# Altium schematic sheet Laser_driver.SchDoc: Title
size 420 x 297 mm; Author: G.Kasprowicz; CompanyName: WUT ISE; DrawnBy: G.Kasprowicz; Organization: WUT ISE; Address1: PW ISE; Address2: Nowowiejska 15/19 00-665 Warsaw; Address3: gkasprow@gmail.com; Revision: 1.0; SheetNumber: -; SheetTotal: -; ModifiedBy: -; CheckedDate: -; Title2: Title2; DivGrp: WUT ISE; Designer: G.Kasprowicz; SPICEModelCacheRYPVXPCY: <root> / <DocumentId>RYPVXPCY</DocumentId> / </root>; ModifiedDate: -; ProjectName: Sensor Box
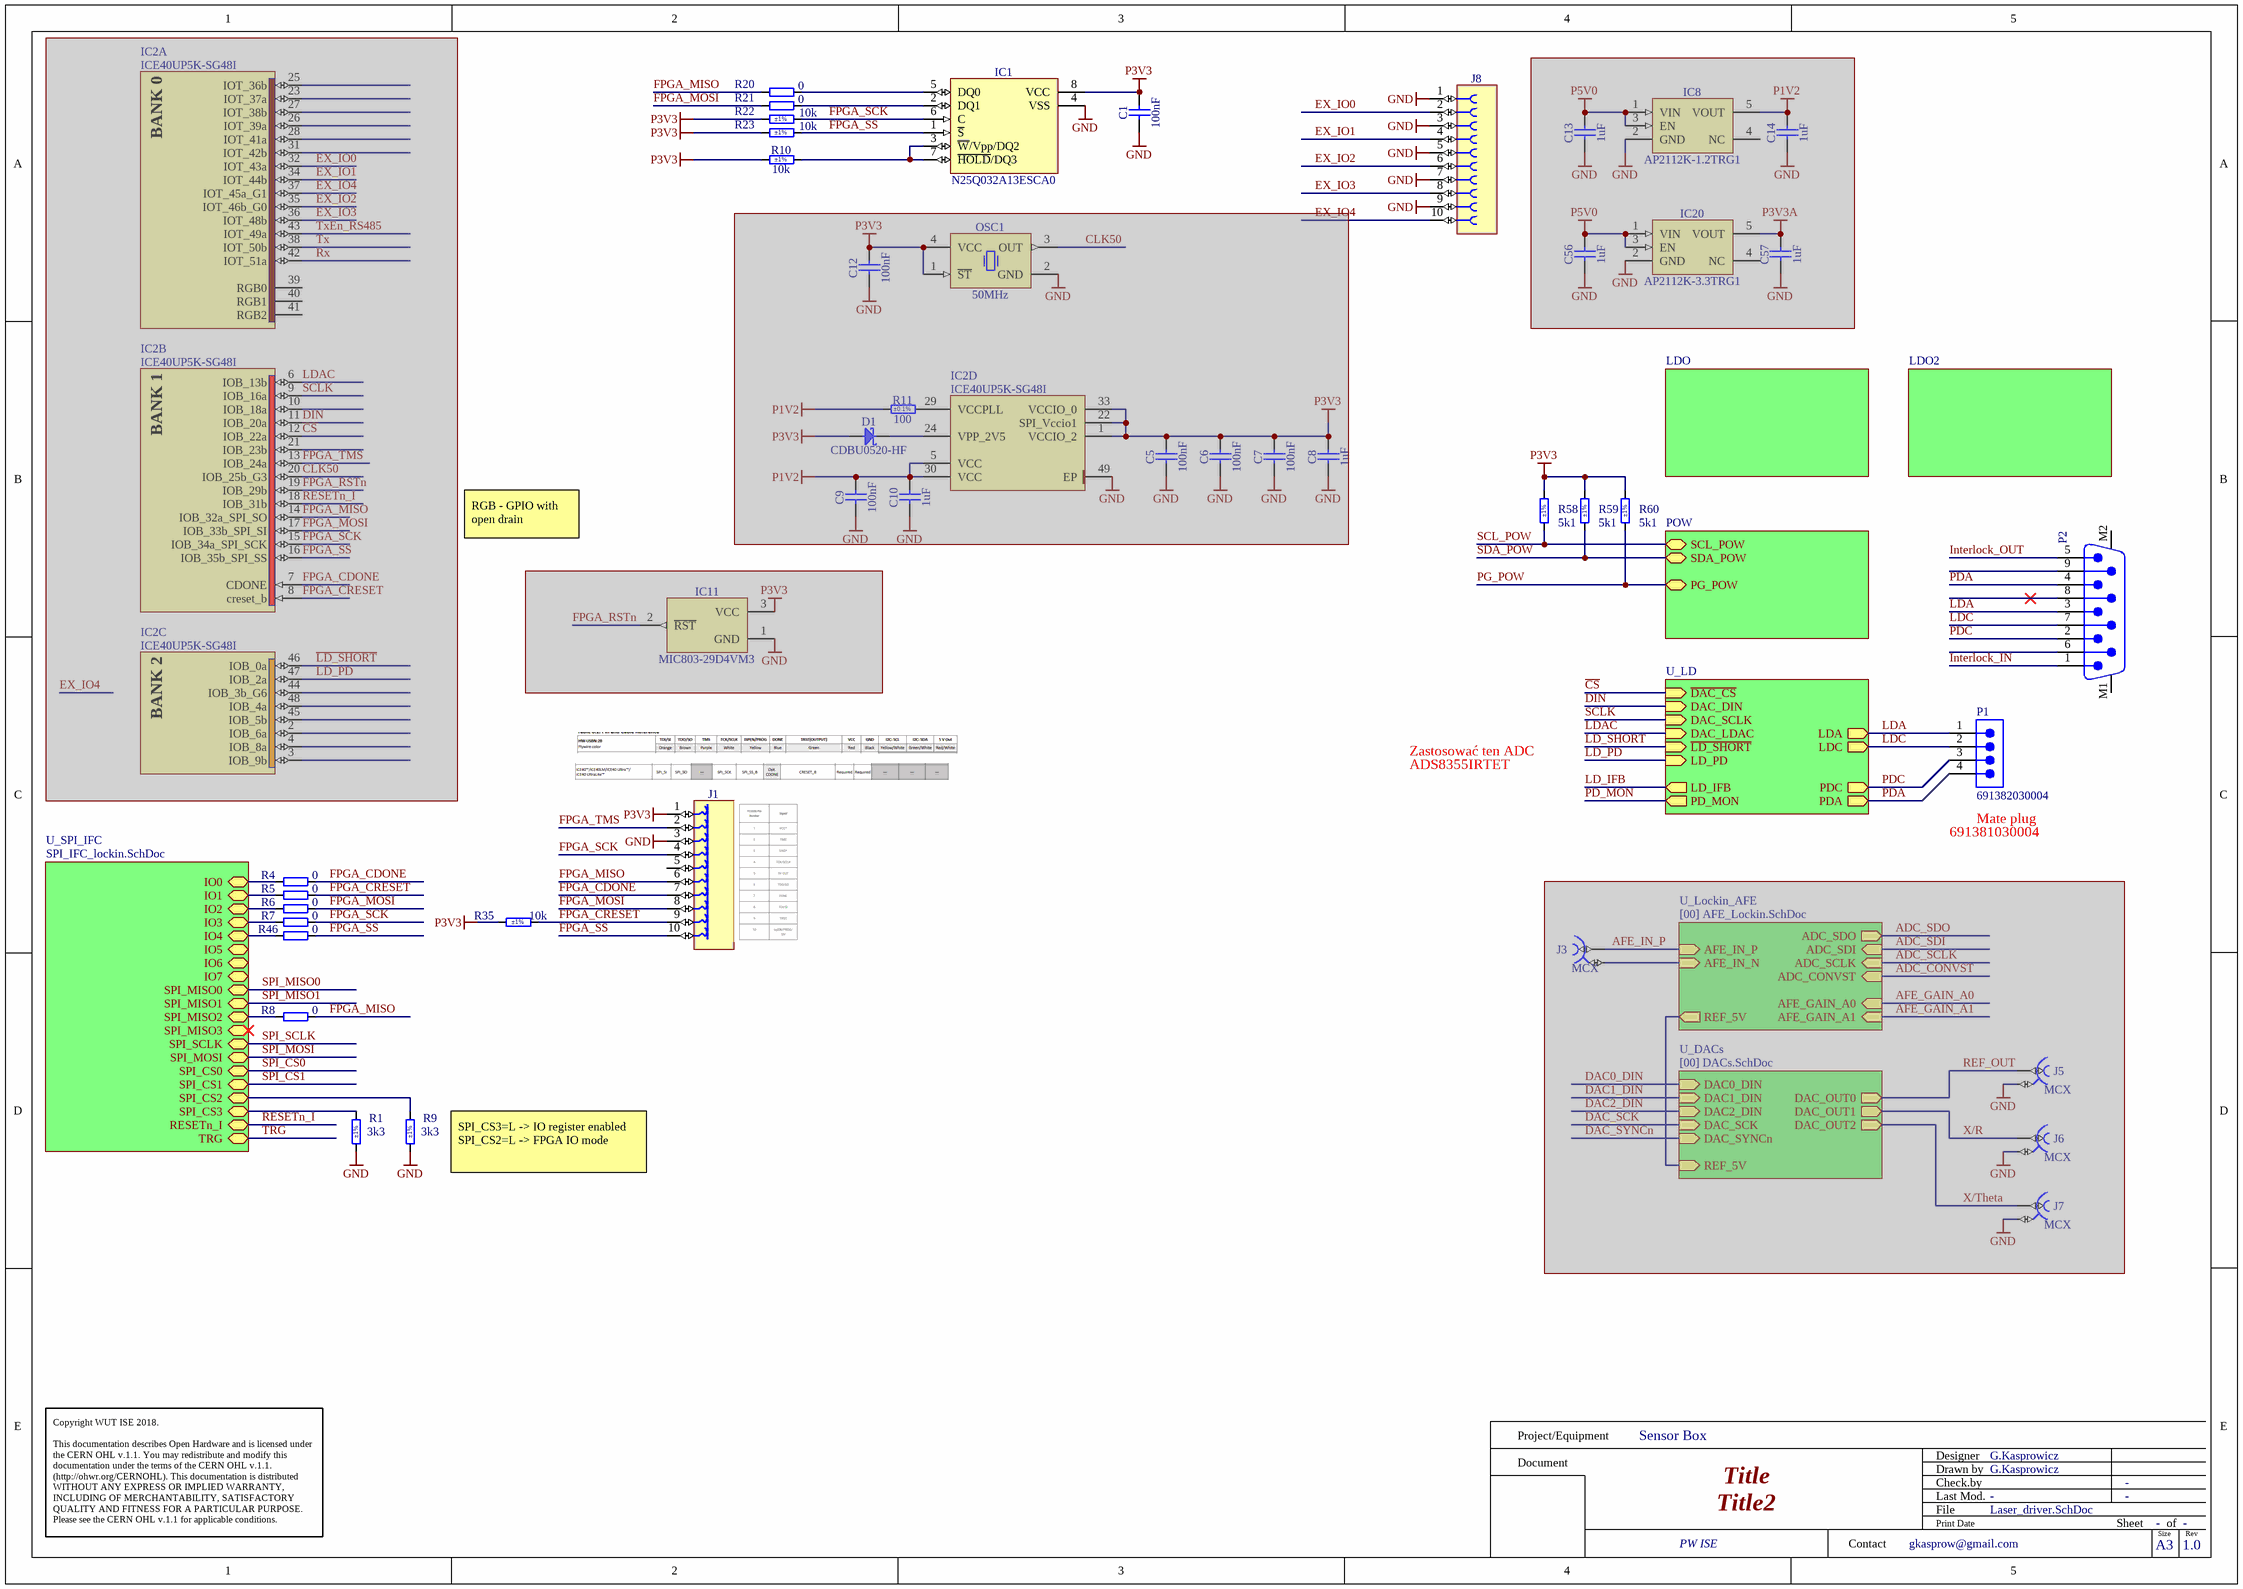
[diagram p0: Laser_driver.SchDoc]

## Parts
C1  100nF  [CAPC1005X55N]
C5  100nF  [CAPC1005X55N]  (masked out: inside a compile mask, not in the netlist)
C6  100nF  [CAPC1005X55N]  (masked out: inside a compile mask, not in the netlist)
C7  100nF  [CAPC1005X55N]  (masked out: inside a compile mask, not in the netlist)
C8  1uF  [CAPC1005X55N]  (masked out: inside a compile mask, not in the netlist)
C9  100nF  [CAPC1005X55N]  (masked out: inside a compile mask, not in the netlist)
C10  1uF  [CAPC1005X55N]  (masked out: inside a compile mask, not in the netlist)
C12  100nF  [CAPC1005X55N]  (masked out: inside a compile mask, not in the netlist)
C13  1uF  [CAPC1005X55N]  (masked out: inside a compile mask, not in the netlist)
C14  1uF  [CAPC1005X55N]  (masked out: inside a compile mask, not in the netlist)
C56  1uF  [CAPC1005X55N]  (masked out: inside a compile mask, not in the netlist)
C57  1uF  [CAPC1005X55N]  (masked out: inside a compile mask, not in the netlist)
D1  CDBU0520-HF  [SOD-523F]  (masked out: inside a compile mask, not in the netlist)
IC1  N25Q032A13ESCA0  [SOIC127P600X175-8N]
IC2  ICE40UP5K-SG48I  [QFN50P700X700X100-49N-S550]  (parts A,B,C,D of 4)  (masked out: inside a compile mask, not in the netlist)
IC8  AP2112K-1.2TRG1  [SOT95P285X140-5N]  (masked out: inside a compile mask, not in the netlist)
IC11  MIC803-29D4VM3  [SOT95P237X112-3N]  (masked out: inside a compile mask, not in the netlist)
IC20  AP2112K-3.3TRG1  [SOT95P285X140-5N]  (masked out: inside a compile mask, not in the netlist)
J1  TC2050-IDC  [TC2050-IDC]  (value not drawn)
J3  MCX  [AMPHENOL_919-109J-51PX]  (masked out: inside a compile mask, not in the netlist)
J5  MCX  [AMPHENOL_919-109J-51PX]  (masked out: inside a compile mask, not in the netlist)
J6  MCX  [AMPHENOL_919-109J-51PX]  (masked out: inside a compile mask, not in the netlist)
J7  MCX  [AMPHENOL_919-109J-51PX]  (masked out: inside a compile mask, not in the netlist)
J8  FFC/FPC  [MOLEX_52745-1097]  (value not drawn)
OSC1  50MHz  [OSC_EPSON_SG-310]  (masked out: inside a compile mask, not in the netlist)
P1  691382030004  [691382030004]
P2  61800929221  [61800929221]  (value not drawn)
R1  3k3  Tolerance: ±1%  [RESC1005X40N]
R4  0  [RESC1005X40N]
R5  0  [RESC1005X40N]
R6  0  [RESC1005X40N]
R7  0  [RESC1005X40N]
R8  0  [RESC1005X40N]
R9  3k3  Tolerance: ±1%  [RESC1005X40N]
R10  10k  Tolerance: ±1%  [RESC1005X40N]
R11  100  Tolerance: ±0.1%  [RESC1005X35N]  (masked out: inside a compile mask, not in the netlist)
R20  0  [RESC1005X40N]
R21  0  [RESC1005X40N]
R22  10k  Tolerance: ±1%  [RESC1005X40N]
R23  10k  Tolerance: ±1%  [RESC1005X40N]
R35  10k  Tolerance: ±1%  [RESC1005X40N]
R46  0  [RESC1005X40N]
R58  5k1  Tolerance: ±1%  [RESC1005X40N]
R59  5k1  Tolerance: ±1%  [RESC1005X40N]
R60  5k1  Tolerance: ±1%  [RESC1005X40N]

## Sub-sheets
LDO = LDO_LD.SchDoc: no entries
LDO2 = OPAmp Supply.SchDoc: no entries
POW = [05] POW_LD.SchDoc: SDA_POW (bidir), SCL_POW (bidir), PG_POW (bidir)
U_DACs = [00] DACs.SchDoc (masked out): DAC0_DIN (in), DAC_SCK (in), DAC_SYNCn (in), DAC1_DIN (in), DAC2_DIN (in), REF_5V (in), DAC_OUT0 (out), DAC_OUT1 (out), DAC_OUT2 (out)
U_LD = LD.SchDoc: LDA (out), LDC (out), PDC (out), PDA (out), ~{LD_SHORT} (in), LD_PD (in), PD_MON (out), ~{DAC_CS} (in), DAC_DIN (in), DAC_SCLK (in), DAC_LDAC (in), LD_IFB (out)
U_Lockin_AFE = [00] AFE_Lockin.SchDoc (masked out): ADC_SDI (in), ADC_SCLK (in), ADC_SDO (out), ADC_CONVST (in), AFE_GAIN_A0 (in), AFE_GAIN_A1 (in), AFE_IN_N (in), AFE_IN_P (in), REF_5V (out)
U_SPI_IFC = SPI_IFC_lockin.SchDoc: IO0 (bidir), IO1 (bidir), IO2 (bidir), IO3 (bidir), IO4 (bidir), IO5 (bidir), IO6 (bidir), IO7 (bidir), SPI_MISO0 (bidir), SPI_MISO1 (bidir), SPI_MISO2 (bidir), SPI_MISO3 (bidir), SPI_SCLK (bidir), SPI_MOSI (bidir), SPI_CS0 (bidir), SPI_CS1 (bidir), SPI_CS2 (bidir), SPI_CS3 (bidir), RESETn_I (bidir), TRG (bidir)

## Nets
GND: C1.1 IC1.4(VSS) J1.3 J8.1 J8.3 J8.5 J8.7 J8.9 R1.2 R9.2
P3V3: C1.2 IC1.8(VCC) J1.1 R10.1 R22.1 R23.1 R35.1 R58.1 R59.1 R60.1
~{CS}: sheet U_LD/~{DAC_CS}
DIN: sheet U_LD/DAC_DIN
EX_IO0: J8.2
EX_IO1: J8.4
EX_IO2: J8.6
EX_IO3: J8.8
FPGA_CDONE: J1.7 R4.2
FPGA_CRESET: J1.9 R5.2 R35.2
FPGA_MISO: J1.6 R8.2 R20.1
FPGA_MOSI: J1.8 R6.2 R21.1
FPGA_SCK: IC1.6(C) J1.4 R7.2 R22.2
FPGA_SS: IC1.1(~{S}) J1.10 R23.2 R46.2
FPGA_TMS: J1.2
Interlock_IN: P2.1
Interlock_OUT: P2.5
~{LD_SHORT}: sheet U_LD/~{LD_SHORT}
LD_IFB: sheet U_LD/LD_IFB
LD_PD: sheet U_LD/LD_PD
LDA: P1.1 P2.3 ; sheet U_LD/LDA
LDAC: sheet U_LD/DAC_LDAC
LDC: P1.2 P2.7 ; sheet U_LD/LDC
PD_MON: sheet U_LD/PD_MON
PDA: P1.4 P2.4 ; sheet U_LD/PDA
PDC: P1.3 P2.2 ; sheet U_LD/PDC
PG_POW: R60.2 ; sheet POW/PG_POW
RESETn_I: sheet U_SPI_IFC/RESETn_I
SCL_POW: R58.2 ; sheet POW/SCL_POW
SCLK: sheet U_LD/DAC_SCLK
SDA_POW: R59.2 ; sheet POW/SDA_POW
SPI_CS0: sheet U_SPI_IFC/SPI_CS0
SPI_CS1: sheet U_SPI_IFC/SPI_CS1
SPI_MISO0: sheet U_SPI_IFC/SPI_MISO0
SPI_MISO1: sheet U_SPI_IFC/SPI_MISO1
SPI_MOSI: sheet U_SPI_IFC/SPI_MOSI
SPI_SCLK: sheet U_SPI_IFC/SPI_SCLK
TRG: sheet U_SPI_IFC/TRG
NetIC1_2: IC1.2(DQ1) R21.2
NetIC1_3: IC1.3(~{W}/Vpp/DQ2) IC1.7(~{HOLD}/DQ3) R10.2
NetIC1_5: IC1.5(DQ0) R20.2
NetR1_1: R1.1 ; sheet U_SPI_IFC/SPI_CS3
NetR4_1: R4.1 ; sheet U_SPI_IFC/IO0
NetR5_1: R5.1 ; sheet U_SPI_IFC/IO1
NetR6_1: R6.1 ; sheet U_SPI_IFC/IO2
NetR7_1: R7.1 ; sheet U_SPI_IFC/IO3
NetR8_1: R8.1 ; sheet U_SPI_IFC/SPI_MISO2
NetR9_1: R9.1 ; sheet U_SPI_IFC/SPI_CS2
NetR46_1: R46.1 ; sheet U_SPI_IFC/IO4

Not connected (* = marked no-connect by the designer): J1 5; J8 10; P2 6 8* 9 M1 M2

## Notes on the sheet
- RGB - GPIO with open drain
- ADS8355IRTET
- Zastosować ten ADC
- (near P1) 691381030004
- (near P1) Mate plug
- (near R9) SPI_CS3=L -> IO register enabled
  SPI_CS2=L -> FPGA IO mode
- Project/Equipment
- Document
- Designer
- Drawn by
- Check.by
- Copyright WUT ISE 2018.
  This documentation describes Open Hardware and is licensed under the CERN OHL v.1.1. You may redistribute and modify this documentation under the terms of the CERN OHL v.1.1. (http://ohwr.org/CERNOHL). This documentation is distributed WITHOUT ANY EXPRESS OR IMPLIED WARRANTY, INCLUDING OF MERCHANTABILITY, SATISFACTORY QUALITY AND FITNESS FOR A PARTICULAR PURPOSE. Please see the CERN OHL v.1.1 for applicable conditions.
- Contact
- File
- Last Mod.
- Print Date
- Sheet
- Size
- A3
- of
- Rev
- (in symbol ICE40UP5K-SG48I, part A) BANK 0
- (in symbol ICE40UP5K-SG48I, part B) BANK 1
- (in symbol ICE40UP5K-SG48I, part C) BANK 2

## Library data of the parts
C1 C5-C7 C9 C12 = CC0402_100NF_16V_10%_X7R: Non-polarised capacitor; Part Description: SMD Multilayer Chip Ceramic Capacitor; Manufacturer: GENERIC; Manufacturer1 Part Number: GRM155R71C104KA88D; Voltage: 16V; TC: X7R; Tolerance: ±10%; Part Number: CC0402_100NF_16V_10%_X7R; Component Kind: Standard; Component Type: Standard; Pin Count: 2; Value: 100nF; Status: Not Recommended; Manufacturer Part Number: CC0402_100NF_16V_10%_X7R; Case: 0402; Mounted: Yes; Socket: No; SMD: Yes; Sense: No; Manufacturer1 Example: MURATA; Manufacturer1 ComponentHeight: 0.55mm; HelpURL: \\cern.ch\dfs\Applications\Altium\Datasheets\CC0402_X7R_MURATA_GRM.pdf; Author: CERN DEM JLC; CreateDate: 05.12.2013; LatestRevisionDate: 03.12.2007
C8 C10 C13 C14 C56 C57 = CC0402_1UF_16V_10%_X5R: Non-polarised capacitor; Part Description: SMD Multilayer Chip Ceramic Capacitor; Manufacturer: GENERIC; Manufacturer1 Part Number: C1005X5R1C105KT; Voltage: 16V; TC: X5R; Tolerance: ±10%; Part Number: CC0402_1UF_16V_10%_X5R; Component Kind: Standard; Component Type: Standard; Pin Count: 2; Value: 1uF; Status: Preferred; Manufacturer Part Number: CC0402_1UF_16V_10%_X5R; Case: 0402; Mounted: Yes; Socket: No; SMD: Yes; Sense: No; Manufacturer1 Example: TDK; Manufacturer1 ComponentHeight: 0.55mm; HelpURL: \\cern.ch\dfs\Applications\Altium\Datasheets\CC0402_X5R_TDK_C.pdf; Author: CERN DEM JLC; CreateDate: 25.10.2012; LatestRevisionDate: 25.10.2012
D1 = CDBU0520-HF: Schottky Diode; Part Description: 20V Surface mount Schottky Barrier Diode; Manufacturer: COMCHIP; Voltage: 20V; Power: 500mA; PressFit: No; Bonding: No; Part Number: CDBU0520-HF; Component Kind: Standard; Component Type: Standard; Device: CDBU0520-HF; PackageDescription: Small Outline Diode Flat Lead (SOD-523F), Body; 1.80mm L X 1mm W X 0.85mm H; Manufacturer Part Number: CDBU0520-HF; Pin Count: 2; Case: SOD-523F; Mounted: Yes; Socket: No; SMD: Yes; Sense: No; ComponentHeight: 1mm; HelpURL: \\cern.ch\dfs\Applications\Altium\Datasheets\CDBU0520-HF.pdf; Author: CERN DEM HF; CreateDate: 13.10.2023; LatestRevisionDate: 13.10.2023
IC1 = N25Q032A13ESCA0: 32Mb, 3V, Multiple I/O Serial Flash Memory; Part Description: 32Mb, 2.7 to 3.6V, Multiple I/O Serial Flash Memory; Manufacturer: MICRON TECHNOLOGY; PressFit: No; Bonding: No; Part Number: N25Q032A13ESCA0; Component Kind: Standard; Component Type: Standard; Device: N25Q032A13ESCA0; PackageDescription: SOIC, 1.27mm Pitch; 8 Pin - Body 4x5mm, IPC Medium Density; Manufacturer Part Number: N25Q032A13ESCA0; Pin Count: 8; Case: SOIC8; Mounted: Yes; Socket: No; SMD: Yes; Sense: No; ComponentHeight: 1.75mm; HelpURL: \\cern.ch\dfs\Applications\Altium\Datasheets\N25Q032A13ESCA0.pdf; Author: CERN DEM HF; CreateDate: 09.12.2024; LatestRevisionDate: 09.12.2024
IC2 = ICE40UP5K-SG48I: ICE40 Ultra FPGA, 3520 Logic Cells, 400 kHz Data Transfer Speed, 48 pin QFN; Part Description: ICE40 Ultra FPGA, 5280 Logic Cells, 400 kHz Data Transfer Speed, 48 pin QFN; Manufacturer: LATTICE SEMICONDUCTOR; PressFit: No; Bonding: No; Part Number: ICE40UP5K-SG48I; Component Kind: Standard; Component Type: Standard; Device: ICE40UP5K-SG48I; PackageDescription: QFN, 0.50mm Pitch, Square; 48 Pin, 7.00mm L X 7.00mm W X 1.00mm H body (w/Thermal Tab 5.50mm X 5.40mm), IPC Medium Density; Manufacturer Part Number: ICE40UP5K-SG48I; Pin Count: 49; Case: QFN48; Mounted: Yes; Socket: No; SMD: Yes; Sense: No; ComponentHeight: 1.00mm; HelpURL: \\cern.ch\dfs\Applications\Altium\Datasheets\ICE40UP5K.pdf; ComponentLink1URL: \\cern.ch\dfs\Applications\Altium\Datasheets\LATTICE_Packege.pdf; ComponentLink1Description: Package; ComponentLink2URL: \\cern.ch\dfs\Applications\Altium\Datasheets\ICE40UP5K_Pinout.xlsx; ComponentLink2Description: Pinout; Author: CERN DEM HF; CreateDate: 16.12.2024; LatestRevisionDate: 16.12.2024
IC8 = REG_AP2112K-1.2: 600mA CMOS Low Dropout Linear Regulator with Enable; Part Description: 1.2V 600mA CMOS Low Dropout Linear Regulator with Enable; Manufacturer: DIODES INCORPORATED; PressFit: No; Bonding: No; Part Number: AP2112K-1.2TRG1; Component Kind: Standard; Component Type: Standard; Device: AP2112K-1.2TRG1; PackageDescription: SOT23, 0.95mm Pitch; 5 Pin, 1.6mm W X 3.0mm L X 1.40mm H body, IPC Medium Density; Manufacturer Part Number: AP2112K-1.2TRG1; Pin Count: 5; Case: SOT25; Mounted: Yes; Socket: No; SMD: Yes; Sense: No; ComponentHeight: 1.4mm; HelpURL: \\cern.ch\dfs\Applications\Altium\Datasheets\AP2112K-3.3TRG1.pdf; Author: GK; CreateDate: 13.12.2017; LatestRevisionDate: 27.06.2022
IC11 = MIC803-29D4VM3: 3.075V Microprocessor Supervisor Circuit With Open-Drain Reset Output; Part Description: 2.93V Microprocessor Supervisor Circuit with Open-Drain Reset Output; Manufacturer: MICROCHIP TECHNOLOGY; PressFit: No; Bonding: No; Part Number: MIC803-29D4VM3; Component Kind: Standard; Component Type: Standard; Device: MIC803-29D4VM3; PackageDescription: SOT, 0.95mm Pitch; 3 Pin, 1.30mm W X 2.92mm L X 1.12mm H body, IPC Medium Density; Manufacturer Part Number: MIC803-29D4VM3; Pin Count: 3; Case: SOT23-3; Mounted: Yes; Socket: No; SMD: Yes; Sense: No; ComponentHeight: 1.12mm; Author: CERN DEM BC; HelpURL: \\cern.ch\dfs\Applications\Altium\Datasheets\MIC803.pdf; CreateDate: 29.04.2020; LatestRevisionDate: 29.04.2020
IC20 = AP2112K-3.3TRG1: 600mA CMOS Low Dropout Linear Regulator with Enable; Part Description: 3.3V 600mA CMOS Low Dropout Linear Regulator with Enable; Manufacturer: DIODES INCORPORATED; PressFit: No; Bonding: No; Part Number: AP2112K-3.3TRG1; Component Kind: Standard; Component Type: Standard; Device: AP2112K-3.3TRG1; PackageDescription: SOT23, 0.95mm Pitch; 5 Pin, 1.6mm W X 3.0mm L X 1.40mm H body, IPC Medium Density; Manufacturer Part Number: AP2112K-3.3; Pin Count: 5; Case: SOT25; Mounted: Yes; Socket: No; SMD: Yes; Sense: No; ComponentHeight: 1.4mm; HelpURL: \\cern.ch\dfs\Applications\Altium\Datasheets\AP2112K-3.3TRG1.pdf; Author: CERN DEM MR; CreateDate: 13.12.2017; LatestRevisionDate: 27.06.2022
J1 = TC2050-IDC: TC2030-MCP and TC2050-IDC Pad Contact; Part Description: 10 X 31mil Diameter SMD Pad For TC2050-IDC Legged Connector; Mounted: No; Part Number: TC2050-IDC; Component Kind: Standard (No BOM); Component Type: Standard (No BOM); Pin Count: 10; Family: TC2050-IDC; Socket: No; SMD: Yes; Sense: No; Status: None; ComponentHeight: 0mm; HelpURL: \\cern.ch\dfs\Applications\Altium\Datasheets\TC2050-IDC.pdf; Author: CERN DEM HF; CreateDate: 02.05.2024; LatestRevisionDate: 02.05.2024; PackageDescription: 10 X 31mil Diameter SMD Pad For TC2030-MCP Legged Connector
J3 J5-J7 = AMPHENOL_919-109J-51PX: Part Description: 50 Ohms, RF Connector, MCX Straight PCB Receptacle Jack; Manufacturer Part Number: 919-109J-51PX (MCX6251B1-3GT30G-50); PressFit: No; Part Number: AMPHENOL_919-109J-51PX; Component Kind: Standard; Component Type: Standard; Pin Count: 5; Family: MCX; Mounted: Yes; Socket: No; SMD: No; Sense: No; Status: None; Manufacturer: AMPHENOL; ComponentHeight: 6.06mm; HelpURL: \\cern.ch\dfs\Applications\Altium\Datasheets\AMPHENOL_919-109J-51PX.pdf; Author: CERN DEM BC; CreateDate: 31.01.2019; LatestRevisionDate: 31.01.2019
J8 = MOLEX_52745-1097: Connector 10 Female; Part Description: 10 Contacts, 0.5mm Pitch, Right Angled Surface Mount FFC/FPC Connector, ZIF, Top Contact Style; Manufacturer: MOLEX; PressFit: No; Part Number: MOLEX_52745-1097; Component Kind: Standard; Component Type: Standard; Pin Count: 10; Family: FFC/FPC; Mounted: Yes; Socket: No; SMD: Yes; Sense: No; Status: None; Manufacturer Part Number: 52745-1097; ComponentHeight: 2mm; HelpURL: \\cern.ch\dfs\Applications\Altium\Datasheets\MOLEX_52745-1097.pdf; Author: CERN DEM JLC; CreateDate: 04.11.2014; LatestRevisionDate: 05.12.2014
OSC1 = OSC_50MHZ_EPSON_SG-310SCN: Oscillator 4 pins 1=\ST 2=GND 3=OUT 4=VCC; Part Description: 3.3V, ±100ppm, 15pF -40..85°C, Stanby Function , Surface Mount Crystal Oscillator (SG-310 Series); Manufacturer: EPSON TOYOCOM; Manufacturer Part Number: SG-310 SCN 50.0000MJ; PressFit: No; Bonding: No; Part Number: OSC_50MHZ_EPSON_SG-310SCN; Component Kind: Standard; Component Type: Standard; PackageDescription: Oscillator, Corner Concave; 4 Pin, 2.5mm L X 3.2mm W X 1.2mm H; Value: 50MHz; Pin Count: 4; Mounted: Yes; Socket: No; SMD: Yes; Sense: No; ComponentHeight: 1.2mm; HelpURL: \\cern.ch\dfs\Applications\Altium\Datasheets\OSC_EPSON_SG-310.pdf; ComponentLink1URL: \\cern.ch\dfs\Applications\Altium\Datasheets\OSC_EPSON_SG-310_Ordering-Informations.pdf; ComponentLink1Description: Ordering Informations; Author: CERN DEM JLC; CreateDate: 31.03.2010; LatestRevisionDate: 31.03.2010
P1 = 691382030004: WR-TBL Series 382 Vertical PCB Header with Flanges, THT, pitch 2.5mm, 04p; Manufacturer: Wurth Elektronik; Modularity: No; Rated Current: 12A; System: Pluggable Connector; Working Voltage: 300V; Manufacturer Part Number: 691382030004; Category: Terminal Block; Match Code: WR-TBL; ComponentLink1Description: Website Link; ComponentLink1URL: https://www.we-online.com/redexpert/article/691382030004?ad; ComponentLink2Description: Datasheet Link; ComponentLink2URL: https://www.we-online.com/redexpert/spec/691382030004?ad; Mount: Through Hole; Min Operating Temperature: -40°C; Max Operating Temperature: 105°C; Packaging: Box; Application: Pluggable; Number of Pins: 4; Number of Rows: 1; Orientation: Vertical; Pitch: 2.5mm
P2 = 61800929221: WR-DSUB Male PCB Connector with Hex Screw, THT, Straight, 9p; Manufacturer: Wurth Elektronik; Contact Resistance: 30mΩ; Rated Current: 3A; Working Voltage: 250VAC; Withstanding Voltage: 1000VAC; Manufacturer Part Number: 61800929221; Category: Input/Output Connector; Match Code: WR-DSUB; ComponentLink1Description: Website Link; ComponentLink1URL: https://www.we-online.com/redexpert/article/61800929221?ad; ComponentLink2Description: Datasheet Link; ComponentLink2URL: https://www.we-online.com/redexpert/spec/61800929221?ad; Mount: Through Hole; Min Operating Temperature: -55°C; Max Operating Temperature: 105°C; Packaging: Tray; Gender: Male; Number of Pins: 9; Orientation: Straight
R1 R9 = R0402_3K3_1%_0.0625W_100PPM: Resistor - 1%; Part Description: General Purpose Thick Film Chip Resistor; Manufacturer: GENERIC; Manufacturer1 Part Number: 232270673302L; TC: ±100ppm/°C; PressFit: No; Part Number: R0402_3K3_1%_0.0625W_100PPM; Component Kind: Standard; Component Type: Standard; Pin Count: 2; Value: 3k3; Status: Not Recommended; Power: 0.0625W; Manufacturer Part Number: R0402_3K3_1%_0.0625W_100PPM; Case: 0402; Mounted: Yes; Sense: No; Socket: No; SMD: Yes; Manufacturer1 Example: YAGEO PHYCOMP; Manufacturer1 ComponentHeight: 0.4mm; HelpURL: \\cern.ch\dfs\Applications\Altium\Datasheets\R0402_Phycomp_RC0402.pdf; Author: CERN DEM JLC; CreateDate: 03.12.2007; LatestRevisionDate: 17.10.2012
R4-R8 R20 R21 R46 = R0402_0R_JUMPER: Resistor; Part Description: 1A (0.05R Max DC Resistance) Zero Ohm Jumper; Manufacturer: GENERIC; Manufacturer1 Part Number: 232270591001L; PressFit: No; Part Number: R0402_0R_JUMPER; Component Kind: Standard; Component Type: Standard; Pin Count: 2; Value: 0; Status: Not Recommended; Manufacturer Part Number: R0402_0R_JUMPER; Case: 0402; Mounted: Yes; Sense: No; Socket: No; SMD: Yes; Manufacturer1 Example: YAGEO PHYCOMP; Manufacturer1 ComponentHeight: 0.4mm; HelpURL: \\cern.ch\dfs\Applications\Altium\Datasheets\R0402_Phycomp_RC0402.pdf; Author: CERN DEM JLC; CreateDate: 03.12.2007; LatestRevisionDate: 17.10.2012
R10 R22 R23 R35 = R0402_10K_1%_0.0625W_100PPM: Resistor - 1%; Part Description: General Purpose Thick Film Chip Resistor; Manufacturer: GENERIC; Manufacturer1 Part Number: 232270671003L; TC: ±100ppm/°C; PressFit: No; Part Number: R0402_10K_1%_0.0625W_100PPM; Component Kind: Standard; Component Type: Standard; Pin Count: 2; Value: 10k; Status: Not Recommended; Power: 0.0625W; Manufacturer Part Number: R0402_10K_1%_0.0625W_100PPM; Case: 0402; Mounted: Yes; Sense: No; Socket: No; SMD: Yes; Manufacturer1 Example: YAGEO PHYCOMP; Manufacturer1 ComponentHeight: 0.4mm; HelpURL: \\cern.ch\dfs\Applications\Altium\Datasheets\R0402_Phycomp_RC0402.pdf; Author: CERN DEM JLC; CreateDate: 03.12.2007; LatestRevisionDate: 17.10.2012
R11 = R0402_100R_0.1%_0.063W_25PPM: Resistor - 0.1%; Part Description: Thin Film Precision Resistor; Manufacturer: GENERIC; Manufacturer1 Part Number: CPF0402B100RE1; Power: 0.063W; TC: ±25ppm/°C; PressFit: No; Part Number: R0402_100R_0.1%_0.063W_25PPM; Component Kind: Standard; Component Type: Standard; Pin Count: 2; Value: 100; Status: Not Recommended; Manufacturer Part Number: R0402_100R_0.1%_0.063W_25PPM; Case: 0402; Mounted: Yes; Sense: No; Socket: No; SMD: Yes; Manufacturer1 Example: TE CONNECTIVITY; Manufacturer1 ComponentHeight: 0.35mm; HelpURL: \\cern.ch\dfs\Applications\Altium\Datasheets\R0402_TYCO_CPF.pdf; Author: CERN DEM JMW; CreateDate: 22.09.2015; LatestRevisionDate: 22.09.2015
R58-R60 = R0402_5K1_1%_0.0625W_100PPM: Resistor - 1%; Part Description: General Purpose Thick Film Chip Resistor; Manufacturer: GENERIC; Manufacturer1 Part Number: 232270675102L; TC: ±100ppm/°C; PressFit: No; Part Number: R0402_5K1_1%_0.0625W_100PPM; Component Kind: Standard; Component Type: Standard; Pin Count: 2; Value: 5k1; Status: Not Recommended; Power: 0.0625W; Manufacturer Part Number: R0402_5K1_1%_0.0625W_100PPM; Case: 0402; Mounted: Yes; Sense: No; Socket: No; SMD: Yes; Manufacturer1 Example: YAGEO PHYCOMP; Manufacturer1 ComponentHeight: 0.4mm; HelpURL: \\cern.ch\dfs\Applications\Altium\Datasheets\R0402_Phycomp_RC0402.pdf; Author: CERN DEM JLC; CreateDate: 03.12.2007; LatestRevisionDate: 17.10.2012